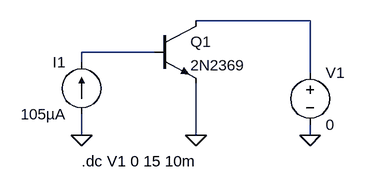
[diagram p0: schematic Draft1.asc]
Draft1.asc, the LTspice schematic file:
Version 4.1
SHEET 1 880 680
WIRE 448 112 272 112
WIRE 208 160 96 160
WIRE 96 176 96 160
WIRE 448 192 448 112
WIRE 96 288 96 256
WIRE 272 288 272 208
WIRE 448 288 448 272
FLAG 448 288 0
FLAG 272 288 0
FLAG 96 288 0
SYMBOL npn 208 112 R0
SYMATTR InstName Q1
SYMATTR Value 2N2369
SYMBOL voltage 448 176 R0
WINDOW 123 0 0 Left 0
WINDOW 39 0 0 Left 0
SYMATTR InstName V1
SYMATTR Value 0
SYMBOL current 96 256 R180
WINDOW 0 24 80 Left 2
WINDOW 3 24 0 Left 2
WINDOW 123 0 0 Left 0
WINDOW 39 0 0 Left 0
SYMATTR InstName I1
SYMATTR Value 105µA
TEXT 96 328 Left 2 !.dc V1 0 15 10m

The netlist it stands for:
* Draft1.asc
Q1 N001 N002 0 0 2N2369
V1 N001 0 0
I1 0 N002 105µA
.model NPN NPN
.model PNP PNP
.lib standard.bjt
.dc V1 0 15 10m
.backanno
.end